# EAGLE design WeMos-ILI9341-Shield (EAGLE 7.7.0)
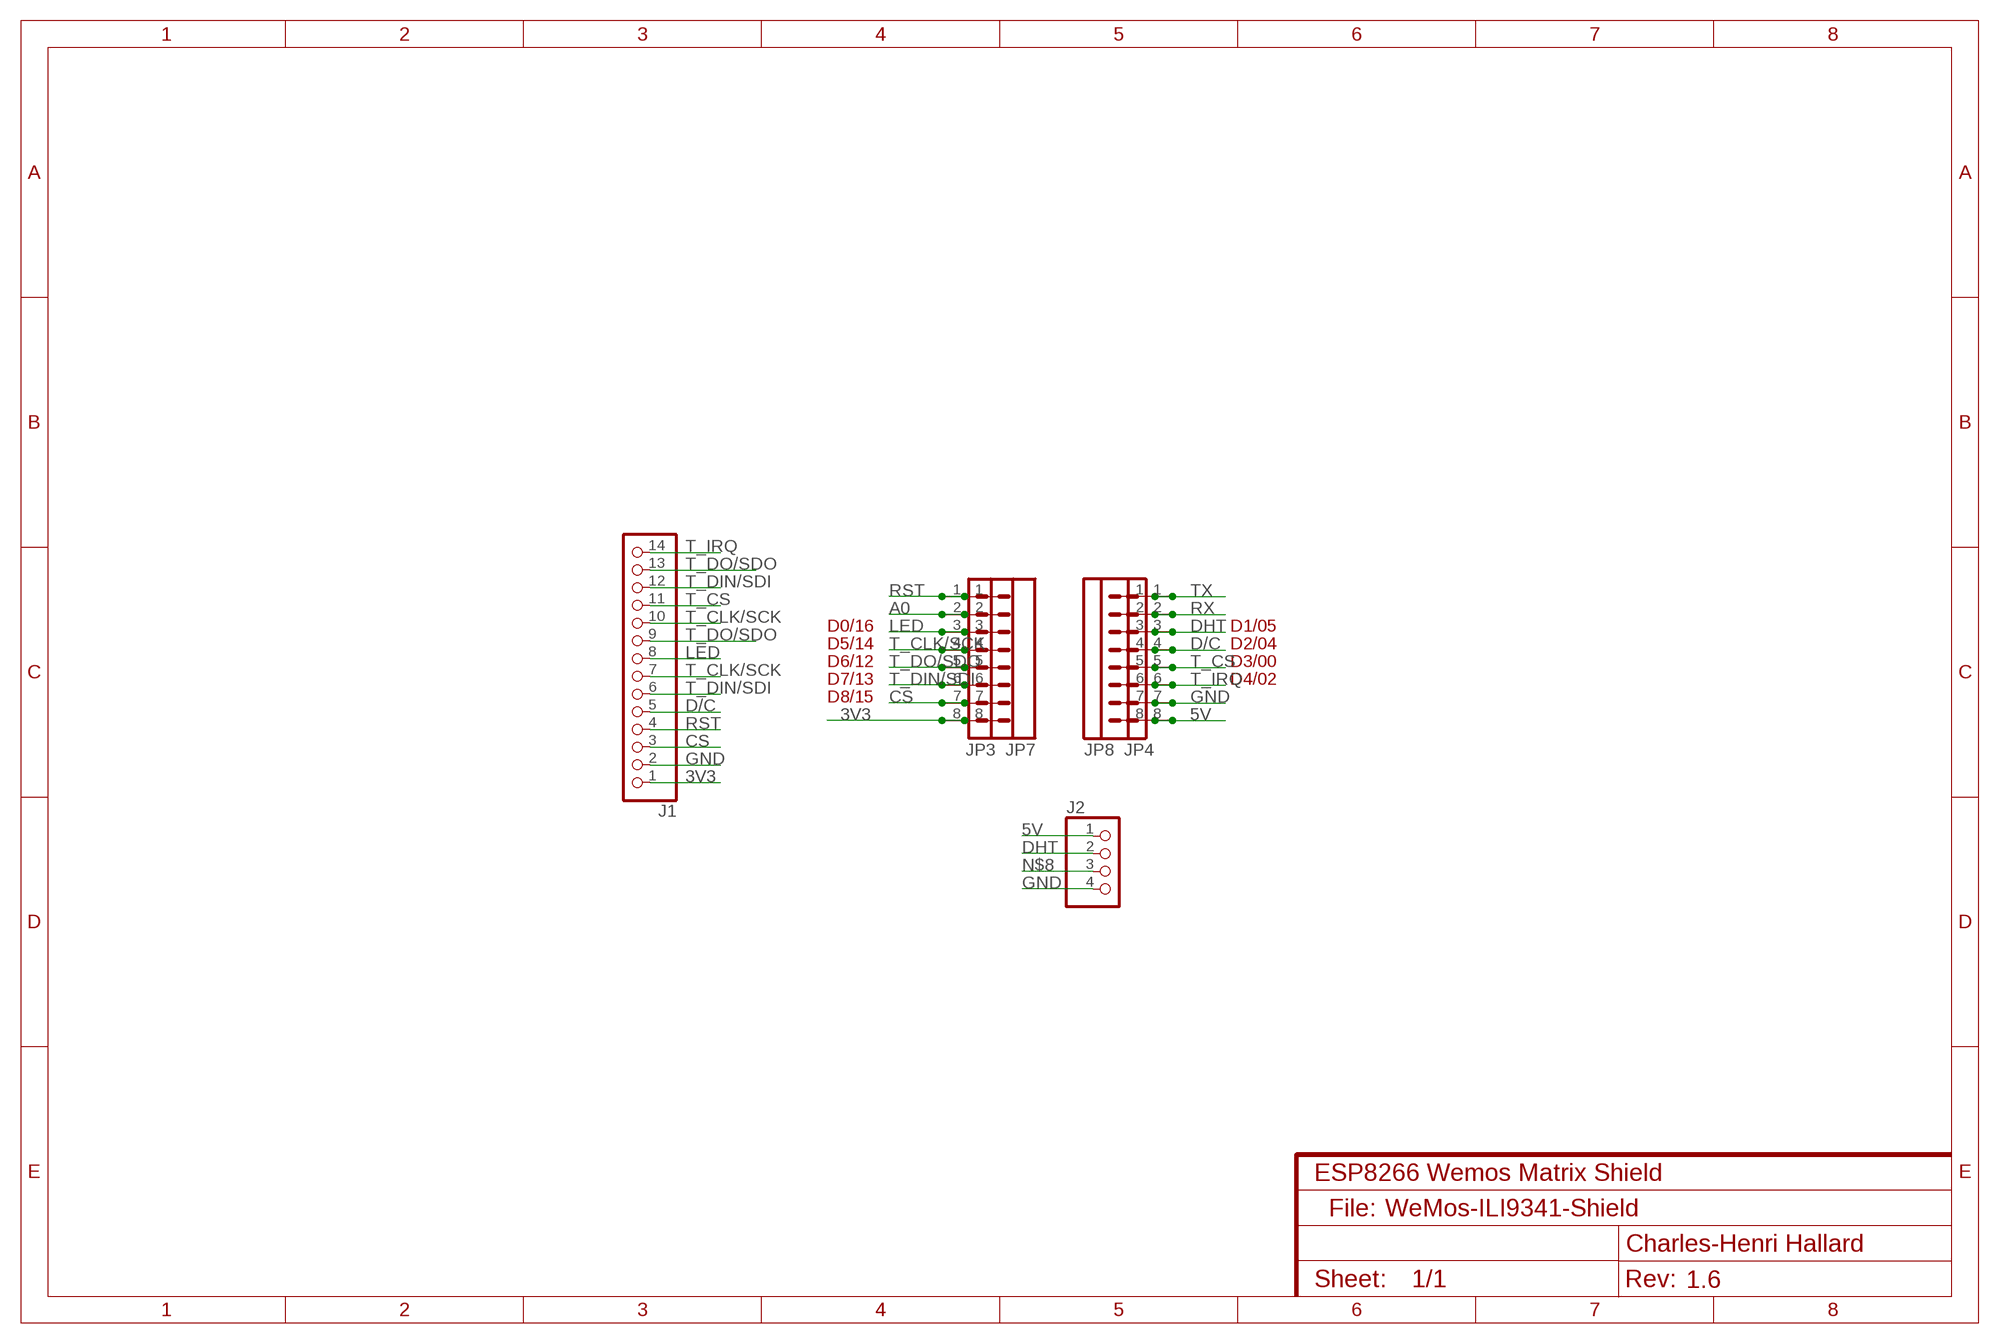
[diagram p0: schematic, sheet 1]
NAME (FRAME-A4L): CNAME: ESP8266 Wemos Matrix Shield; CREVISION: 1.6; DESIGNER: Charles-Henri Hallard

## Parts
J1  PINHD-1X14  [1X14]
J2  HEADER-1X4  [1X04_OVAL]
JP3  M08NO_SILK_FEMALE_PTH  [1X08_NO_SILK]
JP4  M08NO_SILK_FEMALE_PTH  [1X08_NO_SILK]
JP7  M08NO_SILK_FEMALE_PTH  [1X08_NO_SILK]
JP8  M08NO_SILK_FEMALE_PTH  [1X08_NO_SILK]

## Nets
3V3: J1.1 JP3.8 JP7.8
5V: J2.1 JP4.8 JP8.8
A0: JP3.2 JP7.2
CS: J1.3 JP3.7 JP7.7
D/C: J1.5 JP4.4 JP8.4
DHT: J2.2 JP4.3 JP8.3
GND: J1.2 J2.4 JP4.7 JP8.7
LED: J1.8 JP3.3 JP7.3
N$8: J2.3
RST: J1.4 JP3.1 JP7.1
RX: JP4.2 JP8.2
T_CLK/SCK: J1.7 J1.10 JP3.4 JP7.4
T_CS: J1.11 JP4.5 JP8.5
T_DIN/SDI: J1.6 J1.12 JP3.6 JP7.6
T_DO/SDO: J1.9 J1.13 JP3.5 JP7.5
T_IRQ: J1.14 JP4.6 JP8.6
TX: JP4.1 JP8.1

## Notes on the sheet
- D0/16 | D1/05
- D5/14 | D2/04
- D6/12 | D3/00
- D7/13 | D4/02
- D8/15
- File:

## Library data of the parts
J1 = pinhead:PINHD-1X14: PIN HEADER
J2 = microbuilder:HEADER-1X4: PIN HEADER
JP3 JP4 JP7 JP8 = SparkFun-Connectors:M08: Header 8 Standard 8-pin 0.1" header. Use with straight break away headers (SKU : PRT-00116), right angle break away headers (PRT-00553), swiss pins (PRT-00743), machine pins (PRT-00117), and female headers (PRT-00115).; PROD_ID: CONN-08438

## Net classes
0 default: width 0.203 mm, drill 0.356 mm, clearance 0.205 mm
1 power: width 0.203 mm, clearance 0.152 mm

## Board
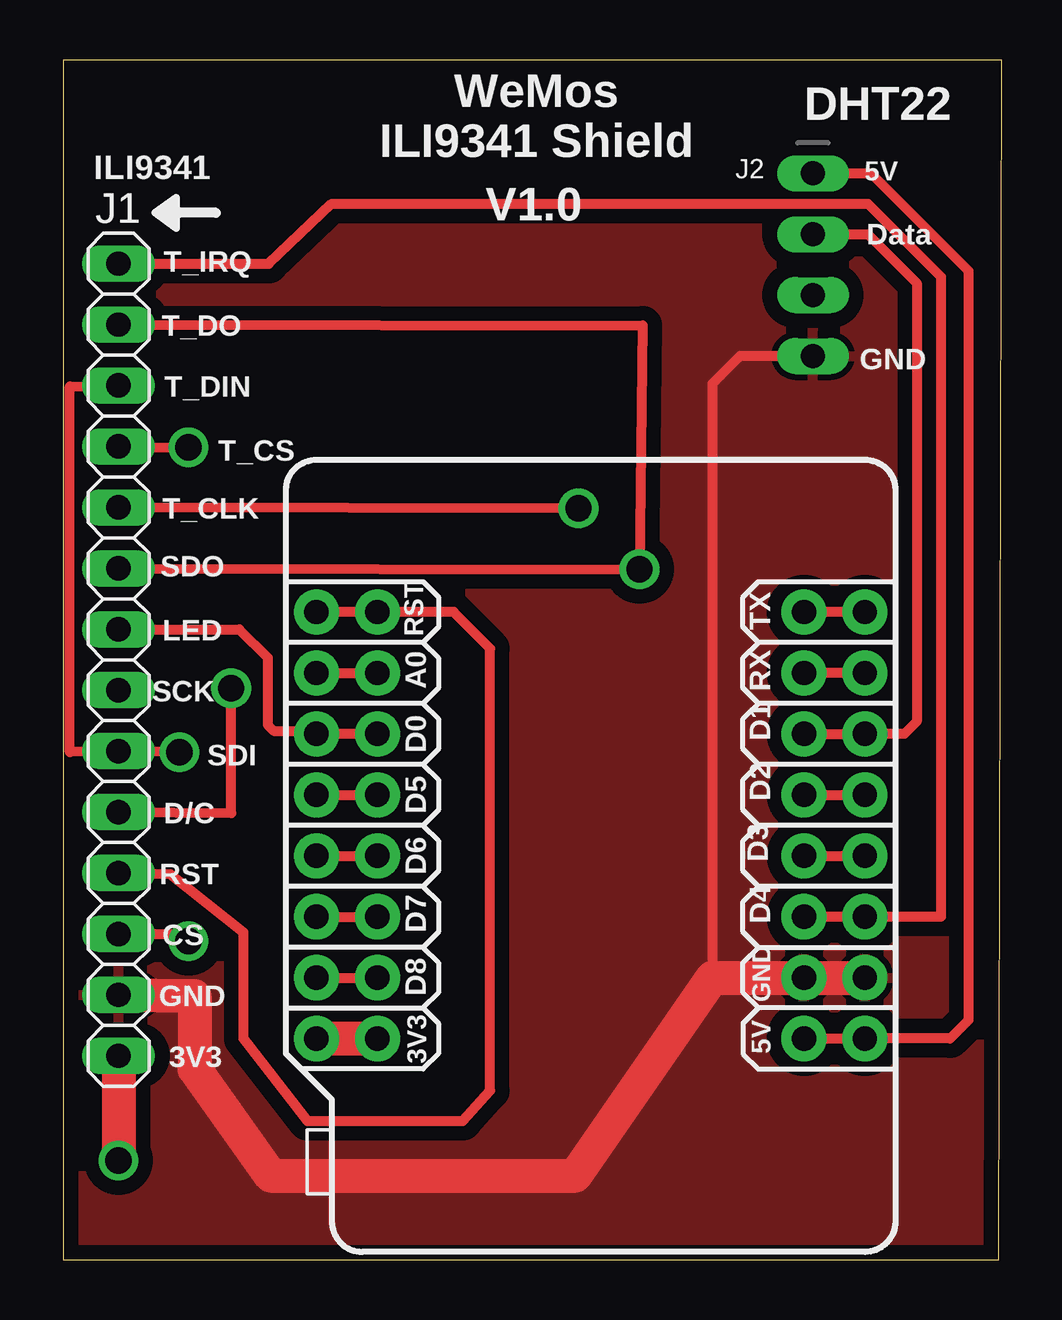
[diagram p1: board, top side]
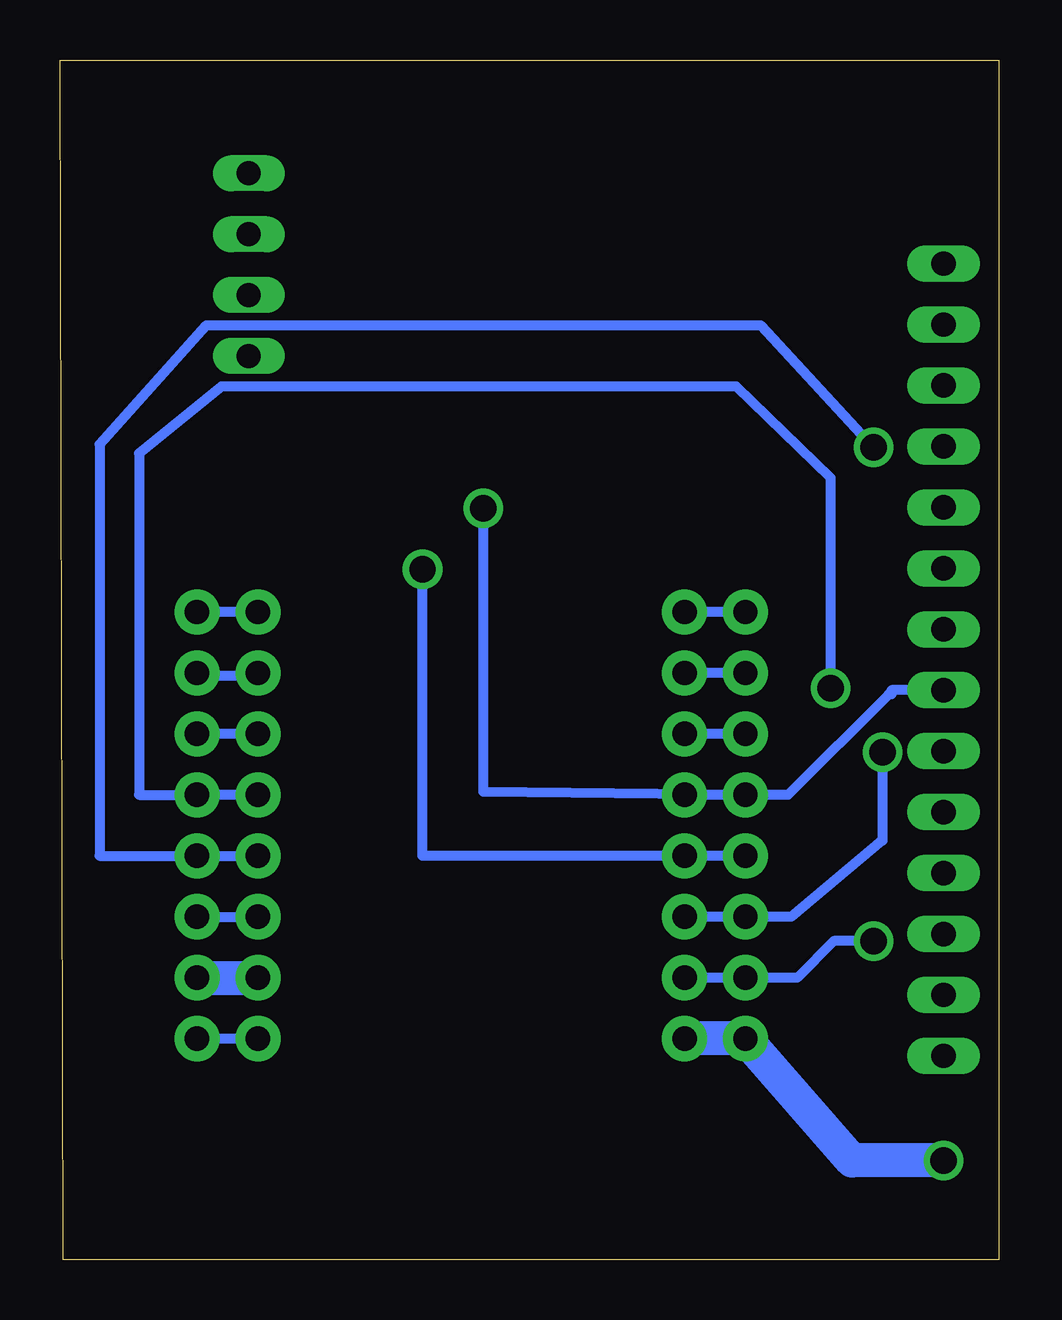
[diagram p2: board, bottom side, seen from below]

Size 39.12 x 50 mm. Coordinates in mm from the lower left corner, seen from the top.
Outline: 39,0 39.12,50 0,50 0,0 39,0
Copper layers (1*16): Top 0.0356mm / dielectric 1.5011mm / Bottom 0.0356mm
Design rules "PCBs_io *": minimum track width 6mil, minimum drill 13mil, track to track 6mil, track to pad 6mil, pad to pad 6mil, via to via 6mil, smd to smd 6mil, copper to edge 15mil, drill to drill 6mil, minimum pad ring 7mil, minimum via ring 7mil, stop-mask expansion 3mil, vias tented up to drill 40mil, thermal gap 10mil

### Footprints (pad centres in the part's own frame; a part is rotated, then mirrored left to right if it is on the bottom)
1X14 = drill 1.016 long: 1 -16.51,0; 2 -13.97,0; 3 -11.43,0; 4 -8.89,0; 5 -6.35,0; 6 -3.81,0; 7 -1.27,0; 8 1.27,0; 9 3.81,0; 10 6.35,0; 11 8.89,0; 12 11.43,0; 13 13.97,0; 14 16.51,0
1X04_OVAL = drill 1 long: 1 -3.81,0; 2 -1.27,0; 3 1.27,0; 4 3.81,0
1X08_NO_SILK = drill 1.016 pad 1.88: 1 0,0; 2 2.54,0; 3 5.08,0; 4 7.62,0; 5 10.16,0; 6 12.7,0; 7 15.24,0; 8 17.78,0

### Placement (x,y rotation side)
J1  2.29,25 90 top
J2  31.25,41.47 270 top
JP3  10.55,26.99 270 bottom
JP4  33.41,26.99 270 bottom
JP7  13.09,26.99 270 bottom
JP8  30.87,26.99 270 bottom

### Tracks (layer width: path | path; a pad name or v marks a point on that pad's centre or on a via)
3V3  (via drill 1.1)
  Top 1.422: J1.1 v2.29,4.13 | JP3.8 13.22,9.21
  Bottom 1.422: JP7.8 JP3.8 6.11,4.13 v2.29,4.13
5V
  Top 0.406: JP8.8 JP4.8 | JP4.8 33.54,9.21 | J2.1 33.66,45.28 37.73,41.21 37.73,9.97 36.97,9.21 JP4.8
  Bottom 0.406: JP4.8 JP8.8
A0
  Top 0.406: JP3.2 JP7.2
  Bottom 0.406: JP3.2 13.22,24.45
CS  (via drill 1.1)
  Top 0.406: JP3.7 JP7.7 | J1.3 4.92,13.57 v5.22,13.27
  Bottom 0.406: v5.22,13.27 6.87,13.27 8.39,11.75 JP3.7
D/C  (via drill 1.1)
  Top 0.406: J1.5 6.99,18.61 v6.99,23.81 6.99,24.07
  Bottom 0.406: JP8.4 JP4.4 35.82,19.37 35.82,33.59 32.39,36.39 10.93,36.39 6.99,32.58 v6.99,23.81
DHT
  Top 0.406: JP8.3 JP4.3 35.06,21.91 35.57,22.42 35.57,40.71 33.54,42.74 J2.2
  Bottom 0.406: JP8.3 33.54,21.91
GND
  Top 0.406: J2.4 28.2,37.66 27.06,36.52 27.06,11.75
  Top 1.422: J1.2 5.47,10.99 5.47,7.94 8.64,3.5 21.34,3.5 27.06,11.75 JP8.7 JP4.7
  Bottom 0.406: 31,11.75 30.87,11.62
  Bottom 1.422: JP4.7 31,11.75
  pour Top (isolate 0.61): 39.12,50.1 39.12,0.07 39,-0.06 0.39,-0.06 0.14,0.19 0.14,49.85 0.26,49.98
LED
  Top 0.406: JP7.3 JP3.3 10.42,22.04 8.77,22.04 8.52,22.29 8.52,25.09 7.33,26.27 J1.8
  Bottom 0.406: JP3.3 13.22,21.91
N$2
  Bottom 0.406: 10.68,11.75 13.22,11.75 13.34,11.88
N$3
  Bottom 0.406: 31,26.99 33.54,26.99
N$4
  Bottom 0.406: 30.87,24.32 33.54,24.32
N$5
  Top 0.406: 31,19.37 33.54,19.37
N$6  (via drill 1.1)
  other vias: 5.22,13.27
RST
  Top 0.406: J1.4 4.45,16.07 7.5,13.66 7.5,9.21 10.17,5.78 16.65,5.78 17.79,7.05 17.79,25.47 16.27,26.99 JP7.1 JP3.1
  Bottom 0.406: JP3.1 JP7.1 13.22,26.86
RX
  Top 0.406: JP4.2 JP8.2
T_CLK/SCK  (via drill 1.1)
  Top 0.406: v21.47,31.31 J1.10 | JP3.4 JP7.4
  Bottom 0.406: JP3.4 JP7.4 | JP3.4 21.47,19.5 v21.47,31.31 | J1.7 4.45,23.73 4.45,23.56 4.58,23.56 8.77,19.37 JP3.4
T_CS  (via drill 1.1)
  Top 0.406: J1.11 v5.22,33.85 | JP8.5 33.54,16.83
  Bottom 0.406: v5.22,33.85 9.91,38.93 33.03,38.93 37.47,33.98 37.47,16.83 JP4.5 JP8.5
T_DIN/SDI  (via drill 1.1)
  Top 0.406: v4.84,21.15 J1.6 0.26,21.15 0.26,36.39 J1.12 | JP3.6 JP7.6
  Bottom 0.406: v4.84,21.15 4.84,17.47 8.64,14.29 JP3.6 JP7.6 13.73,14.29
T_DO/SDO  (via drill 1.1)
  Top 0.406: J1.9 v24.01,28.77 24.14,38.93 J1.13 | JP3.5 JP7.5
  Bottom 0.406: JP3.5 24.01,16.83 v24.01,28.77
T_IRQ
  Top 0.406: J1.14 8.56,41.51 11.18,44.01 33.54,44.01 36.59,40.96 36.59,14.29 JP4.6 JP8.6
  Bottom 0.406: 33.54,14.29 JP8.6
TX
  Top 0.406: JP4.1 JP8.1

### Text on the board
tNames: WeMos / ILI9341 Shield | DHT22 | ILI9341 | 5V | V1.0 | Data | T_IRQ | T_DO | GND | T_DIN | T_CS | T_CLK | SDO | LED | RST | TX | SCK | A0 | RX | D1 | SDI | D0 | D/C | D5 | D2 | D3 | RST | D6 | CS | D7 | D4 | GND | D8 | GND | 5V | 3V3 | 3V3
_tNames: J2 | J1